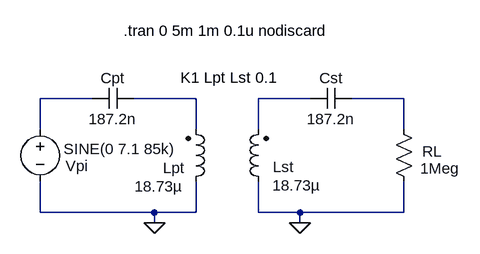
[diagram p0: schematic PSSSComp.asc]
PSSSComp.asc, the LTspice schematic file:
Version 4
SHEET 1 932 680
WIRE 96 240 16 240
WIRE 256 240 160 240
WIRE 432 240 352 240
WIRE 576 240 496 240
WIRE 16 288 16 240
WIRE 256 288 256 240
WIRE 352 288 352 240
WIRE 576 288 576 240
WIRE 16 416 16 368
WIRE 192 416 16 416
WIRE 256 416 256 368
WIRE 256 416 192 416
WIRE 352 416 352 368
WIRE 416 416 352 416
WIRE 576 416 576 368
WIRE 576 416 416 416
WIRE 192 432 192 416
WIRE 416 432 416 416
FLAG 192 432 0
FLAG 416 432 0
SYMBOL ind2 240 384 M180
WINDOW 0 -35 37 Left 2
WINDOW 3 -79 8 Left 2
SYMATTR InstName Lpt
SYMATTR Value 18.73µ
SYMATTR Type ind
SYMBOL ind2 368 384 R180
WINDOW 0 -39 38 Left 2
WINDOW 3 -80 10 Left 2
SYMATTR InstName Lst
SYMATTR Value 18.73µ
SYMATTR Type ind
SYMATTR SpiceLine Rser=0
SYMBOL res 560 272 R0
WINDOW 0 44 50 Left 2
WINDOW 3 41 76 Left 2
SYMATTR InstName RL
SYMATTR Value 1Meg
SYMBOL cap 496 224 R90
WINDOW 0 0 32 VBottom 2
WINDOW 3 32 32 VTop 2
SYMATTR InstName Cst
SYMATTR Value 187.2n
SYMBOL cap 160 224 R90
WINDOW 0 0 32 VBottom 2
WINDOW 3 32 32 VTop 2
SYMATTR InstName Cpt
SYMATTR Value 187.2n
SYMBOL voltage 16 272 R0
WINDOW 0 39 72 Left 2
WINDOW 3 36 46 Left 2
SYMATTR InstName Vpi
SYMATTR Value SINE(0 7.1 85k)
TEXT 232 208 Left 2 !K1 Lpt Lst 0.1
TEXT 144 136 Left 2 !.tran 0 5m 1m 0.1u nodiscard

The netlist it stands for:
* PSSSComp.asc
Lpt 0 N002 18.73µ
Lst 0 N003 18.73µ Rser=0
RL N004 0 1Meg
Cst N004 N003 187.2n
Cpt N002 N001 187.2n
Vpi N001 0 SINE(0 7.1 85k)
K1 Lpt Lst 0.1
.tran 0 5m 1m 0.1u nodiscard
.backanno
.end